# EAGLE design Grove - Water  Atomization v1.0 (EAGLE 7.1.0)

## Sheet 1 of 2
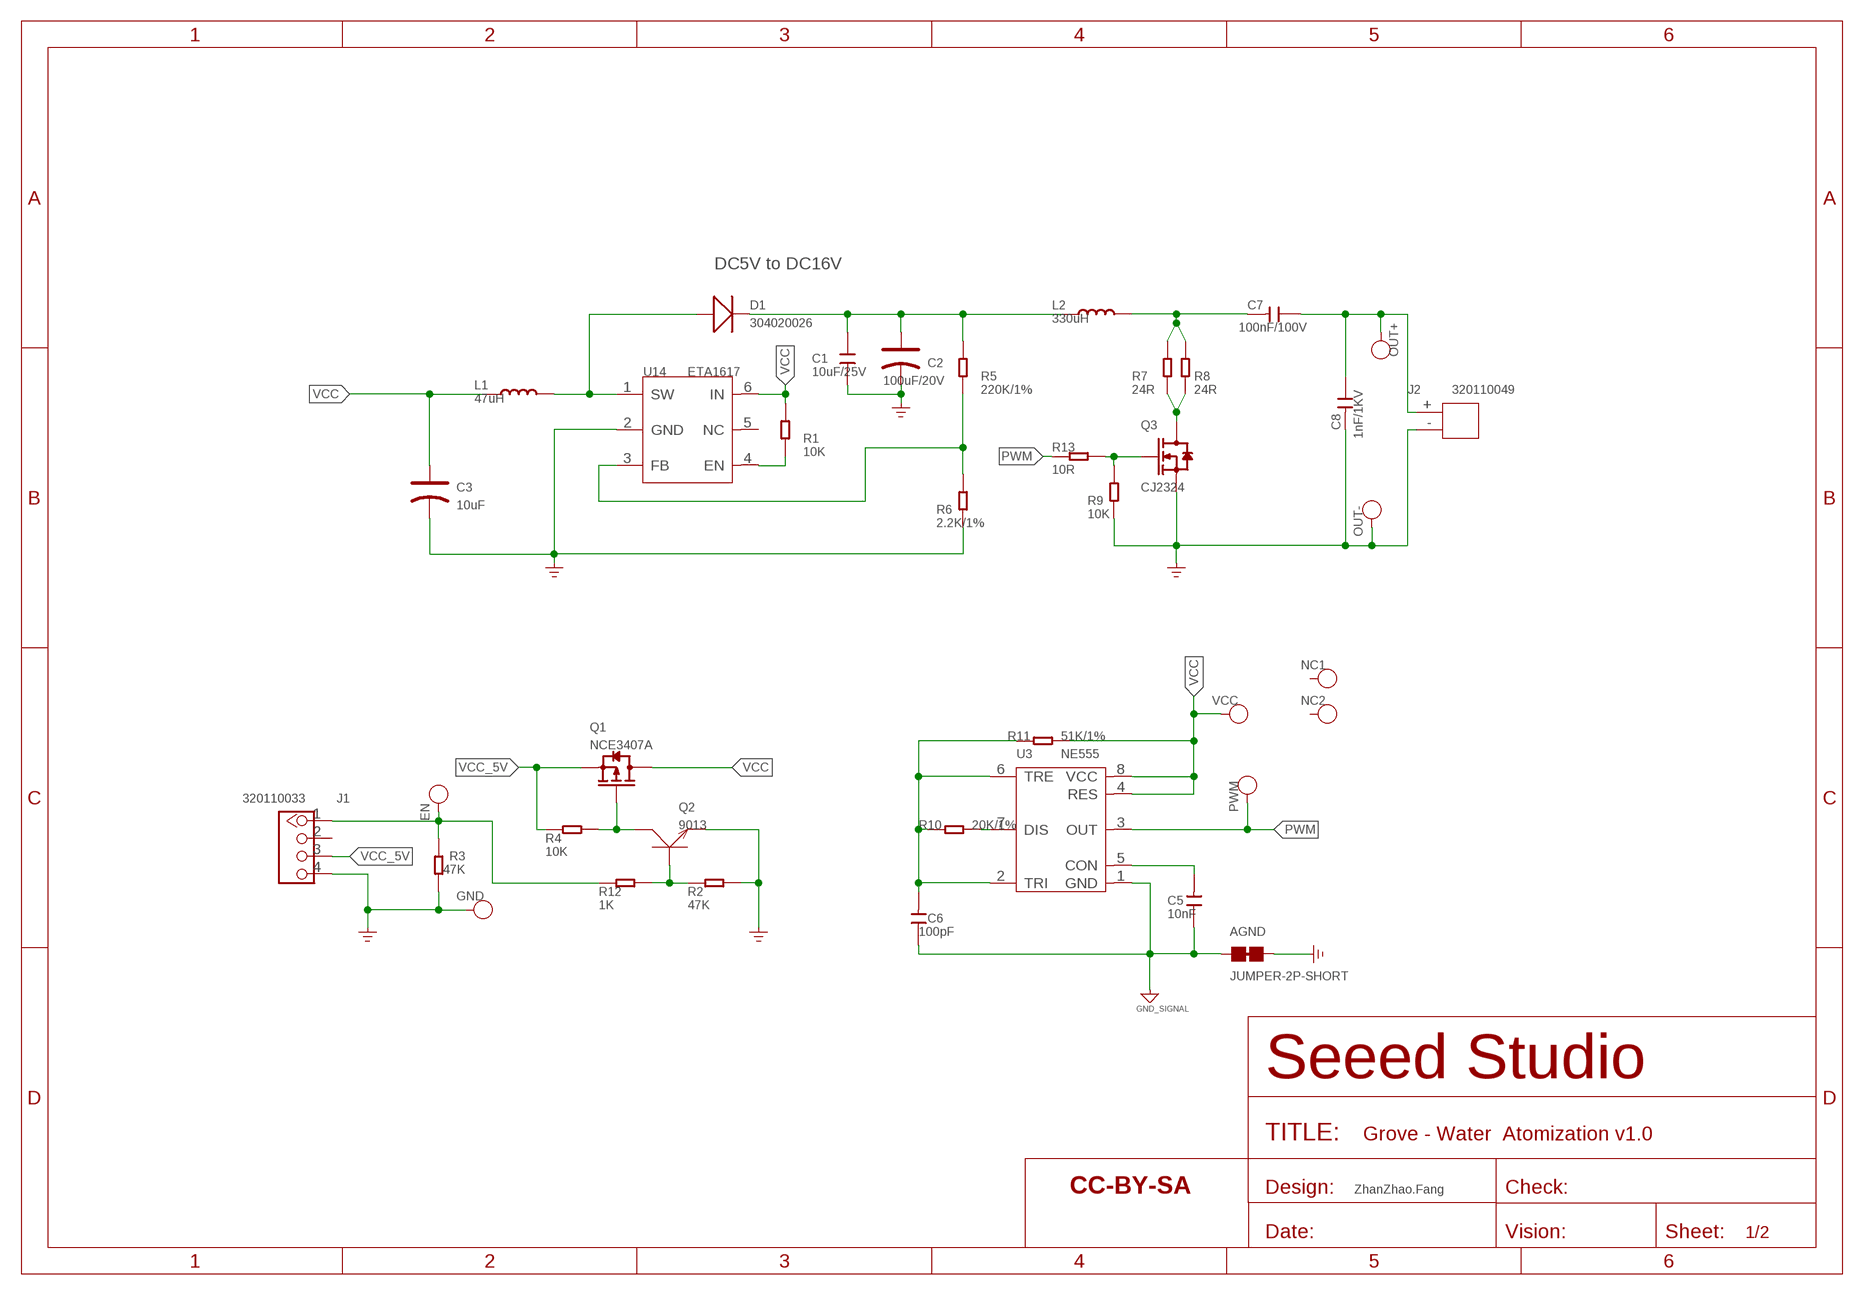
[diagram p0: schematic, sheet 1]

### Parts
AGND  JUMPER-2P-SHORT  [2P-SMD-SHORT]
C1  10uF/25V  CAP-1206  [C1206]
C2  100uF/20V  CAP-POLAR-AVX-D  [AVX-D]
C3  10uF  CAP-POLAR-AVX-B  [AVX-B]
C5  10nF  CAP-0402  [C0402]
C6  100pF  CAP-0402  [C0402]
C7  100nF/100V  CAP-0805  [C0805]
C8  1nF/1KV  CAP-1206  [C1206]
D1  304020026  DIODE'0805'  [SOD-323]
EN  DNP  TEST-POINT'4545'  [TP-D45MIL]
GND  DNP  TEST-POINT'4545'  [TP-D45MIL]
J1  320110033  GROVE-CONNECTOR-DIP-2.0  [HW4-2.0]
J2  320110049  JST-2P-DIP'2.0'  [H2-2.0-6X4.5MM]
L1  47uH  INDUCTOR/FERRITE-BEAD  [INT2-SMD-4.8X4.8X3MM]
L2  330uH  INDUCTOR/FERRITE-BEAD  [INT2-SMD-4.8X4.8X3MM]
NC1  DNP  TEST-POINT'4545'  [TP-D45MIL]
NC2  DNP  TEST-POINT'4545'  [TP-D45MIL]
OUT+  DNP  TEST-POINT'4545'  [TP-D45MIL]
OUT-  DNP  TEST-POINT'4545'  [TP-D45MIL]
PWM  DNP  TEST-POINT'4545'  [TP-D45MIL]
Q1  NCE3407A  MOSFET-P'SI2323CDS/SI2305DS<BR>'  [SOT-23]
Q2  9013  TRANSISTOR-NPN-SOT323  [SOT-323]
Q3  CJ2324  MOSFET-N'SOT23'  [SOT-23]
R1  10K  RES-0402  [R0402]
R2  47K  RES-0402  [R0402]
R3  47K  RES-0402  [R0402]
R4  10K  RES-0402  [R0402]
R5  220K/1%  RES-0402  [R0402]
R6  2.2K/1%  RES-0402  [R0402]
R7  24R  RES-0805  [R0805]
R8  24R  RES-0805  [R0805]
R9  10K  RES-0402  [R0402]
R10  20K/1%  RES-0402  [R0402]
R11  51K/1%  RES-0402  [R0402]
R12  1K  RES-0402  [R0402]
R13  10R  RES-0402  [R0402]
U3  NE555  CLOCK/TIMING-NE555'DR'  [SOIC8-1.27-5X4MM]
U14  ETA1617  PMIC-ETA1617  [SOT-23-6]
U$1  DNP  SEEEDSTUDIO-OPEN-SCH-FRAME  [SEEEDSTUDIO-PCB-FRAME]
VCC  DNP  TEST-POINT'4545'  [TP-D45MIL]

### Nets
\GND: AGND.1 C5.1 C6.1 U3.1(GND) ; supply symbol labelled GND_SIGNAL
EN: EN.T J1.1 R3.1 R12.2
FB: R5.1 R6.2 U14.3(FB)
GND: AGND.2 C1.2 C2.- C3.- C8.2 GND.T J1.4 J2.- OUT-.T Q2.2(E) Q3.2(S) R2.1 R3.2 R6.1 R9.1 U14.2(GND) ; supply symbol labelled GND_POWER
N$1: Q3.3(D) R7.1 R8.1
N$2: D1.+ L1.2 U14.1(SW)
N$3: R1.1 U14.4(EN)
N$4: C1.1 C2.+ D1.- L2.1 R5.2
N$5: Q1.1(G) Q2.3(C) R4.1
N$8: Q2.1(B) R2.2 R12.1
N$9: C5.2 U3.5(CON)
N$11: Q3.1(G) R9.2 R13.1
N$12: C7.2 L2.2 R7.2 R8.2
N$14: C7.1 C8.1 J2.+ OUT+.T
N$15: R10.1 U3.7(DIS)
N$18: C6.2 R10.2 R11.1 U3.2(TRI) U3.6(TRE)
PWM: PWM.T R13.2 U3.3(OUT)
VCC: C3.+ L1.1 Q1.3(D) R1.2 R11.2 U3.4(RES) U3.8(VCC) U14.6(IN) VCC.T
VCC_5V: J1.3 Q1.2(S) R4.2
Unconnected: J1.2 NC1.T NC2.T U14.5(NC)

### Notes on the sheet
- DC5V to DC16V
- ZhanZhao.Fang

## Sheet 2 of 2

## Library data of the parts
AGND = Discrete-new:JUMPER-2P-SHORT
C1 C5-C8 = Discrete-new:CAP: Ceramic Capacitors
C2 C3 = Discrete-new:CAP-POLAR: Electrolytic Capacitors,Tantalum Capacitors and Super Capacitors
D1 = Discrete-new:DIODE*
EN GND NC1 NC2 OUT+ OUT- PWM VCC = Discrete-new:TEST-POINT; PARTNO: DNP
J1 = Connector-new:GROVE-CONNECTOR-DIP: 4P-2.0:320110033;4P-2.0-90D:320110034
J2 = Connector-new:JST-2P-DIP: 2P-2.0:320110049;2P-2.0-90D:320110027;2P-2.54:320110053;2P-2.54-90D:320110000
L1 L2 = Discrete-new:INDUCTOR/FERRITE-BEAD
Q1 = Discrete-new:MOSFET-P
Q2 = Discrete-new:TRANSISTOR-NPN: NPN audion
Q3 = Discrete-new:MOSFET-N
R1-R13 = Discrete-new:RES
U3 = IC-new:CLOCK/TIMING-NE555: DIP-8:310110001;SOIC-8:310110013;TSSOP-8:310110002
U14 = template:PMIC-ETA1617
U$1 = moudle-new:SEEEDSTUDIO-OPEN-SCH-FRAME

## Board
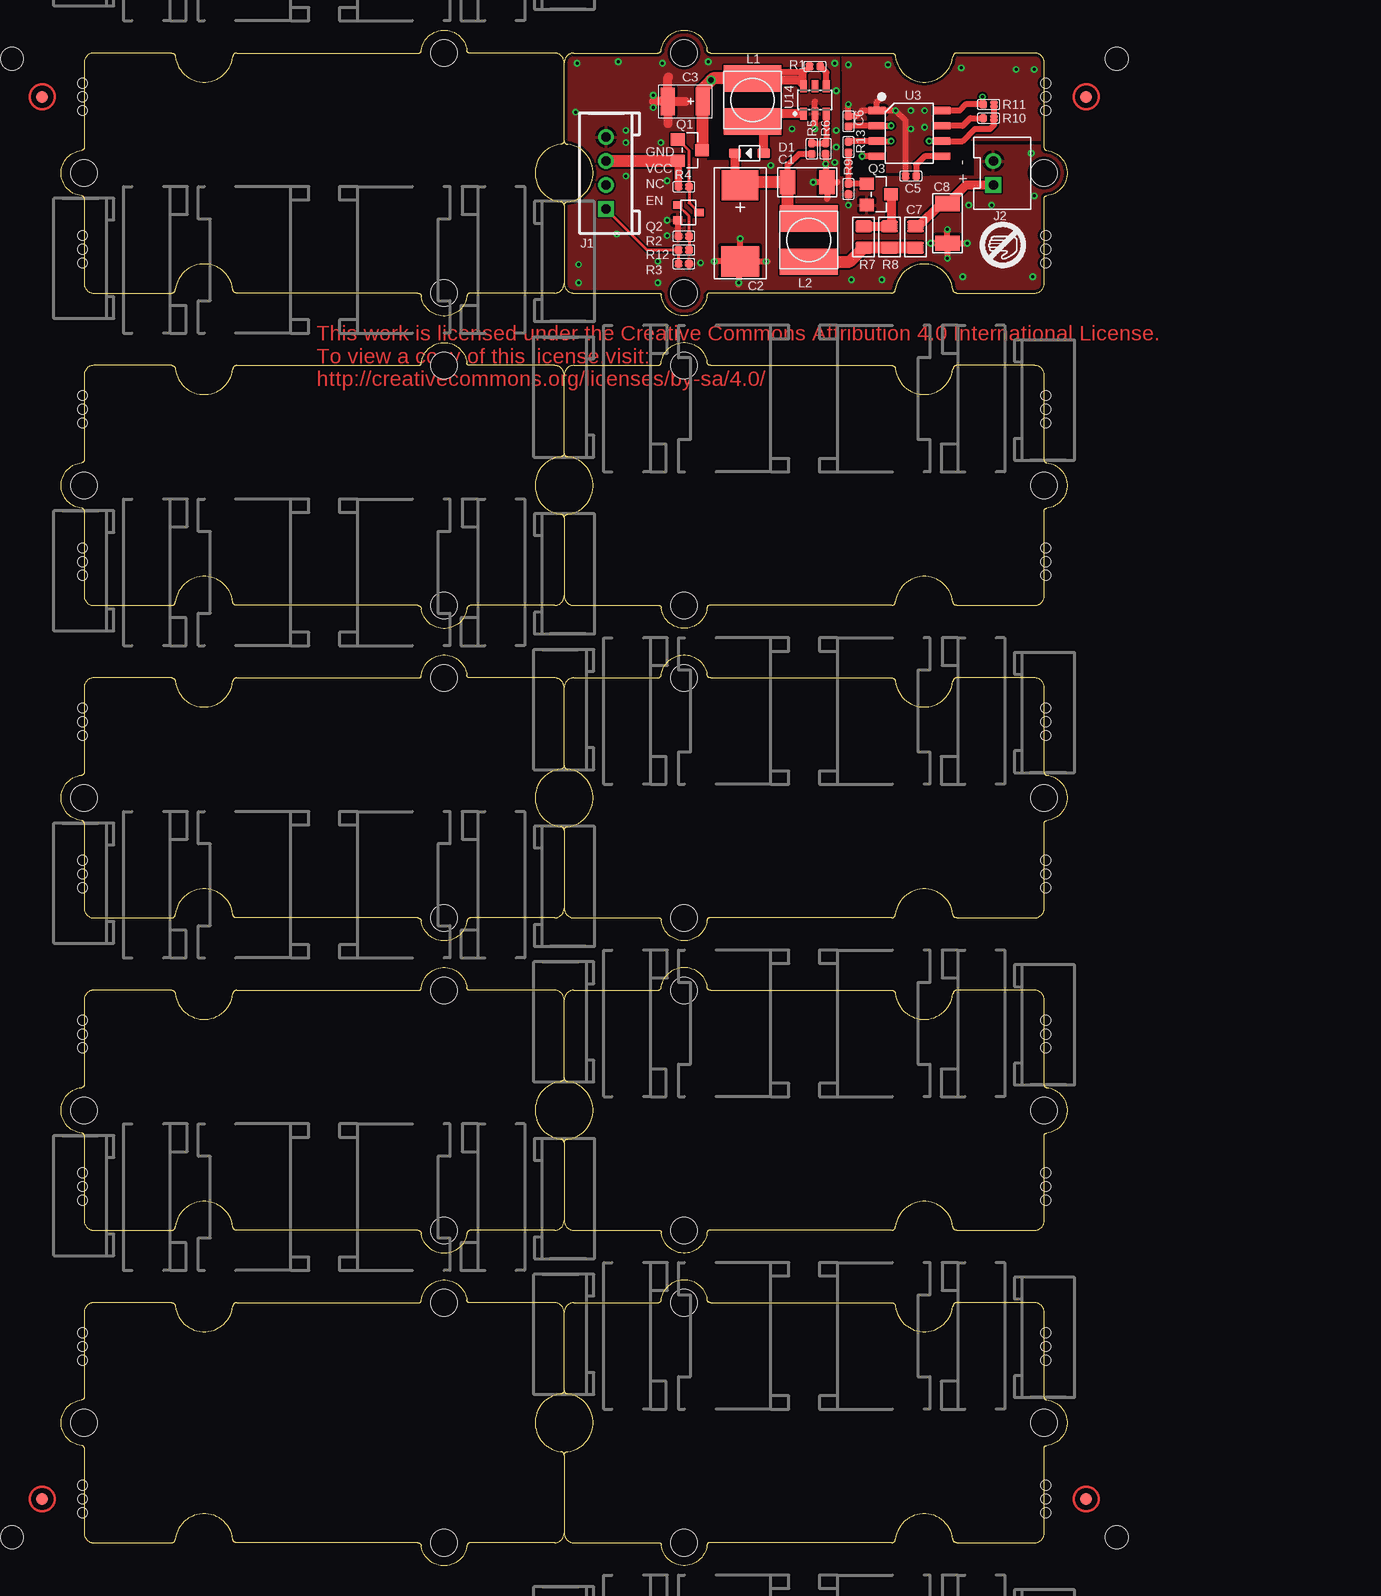
[diagram p1: board, top side]
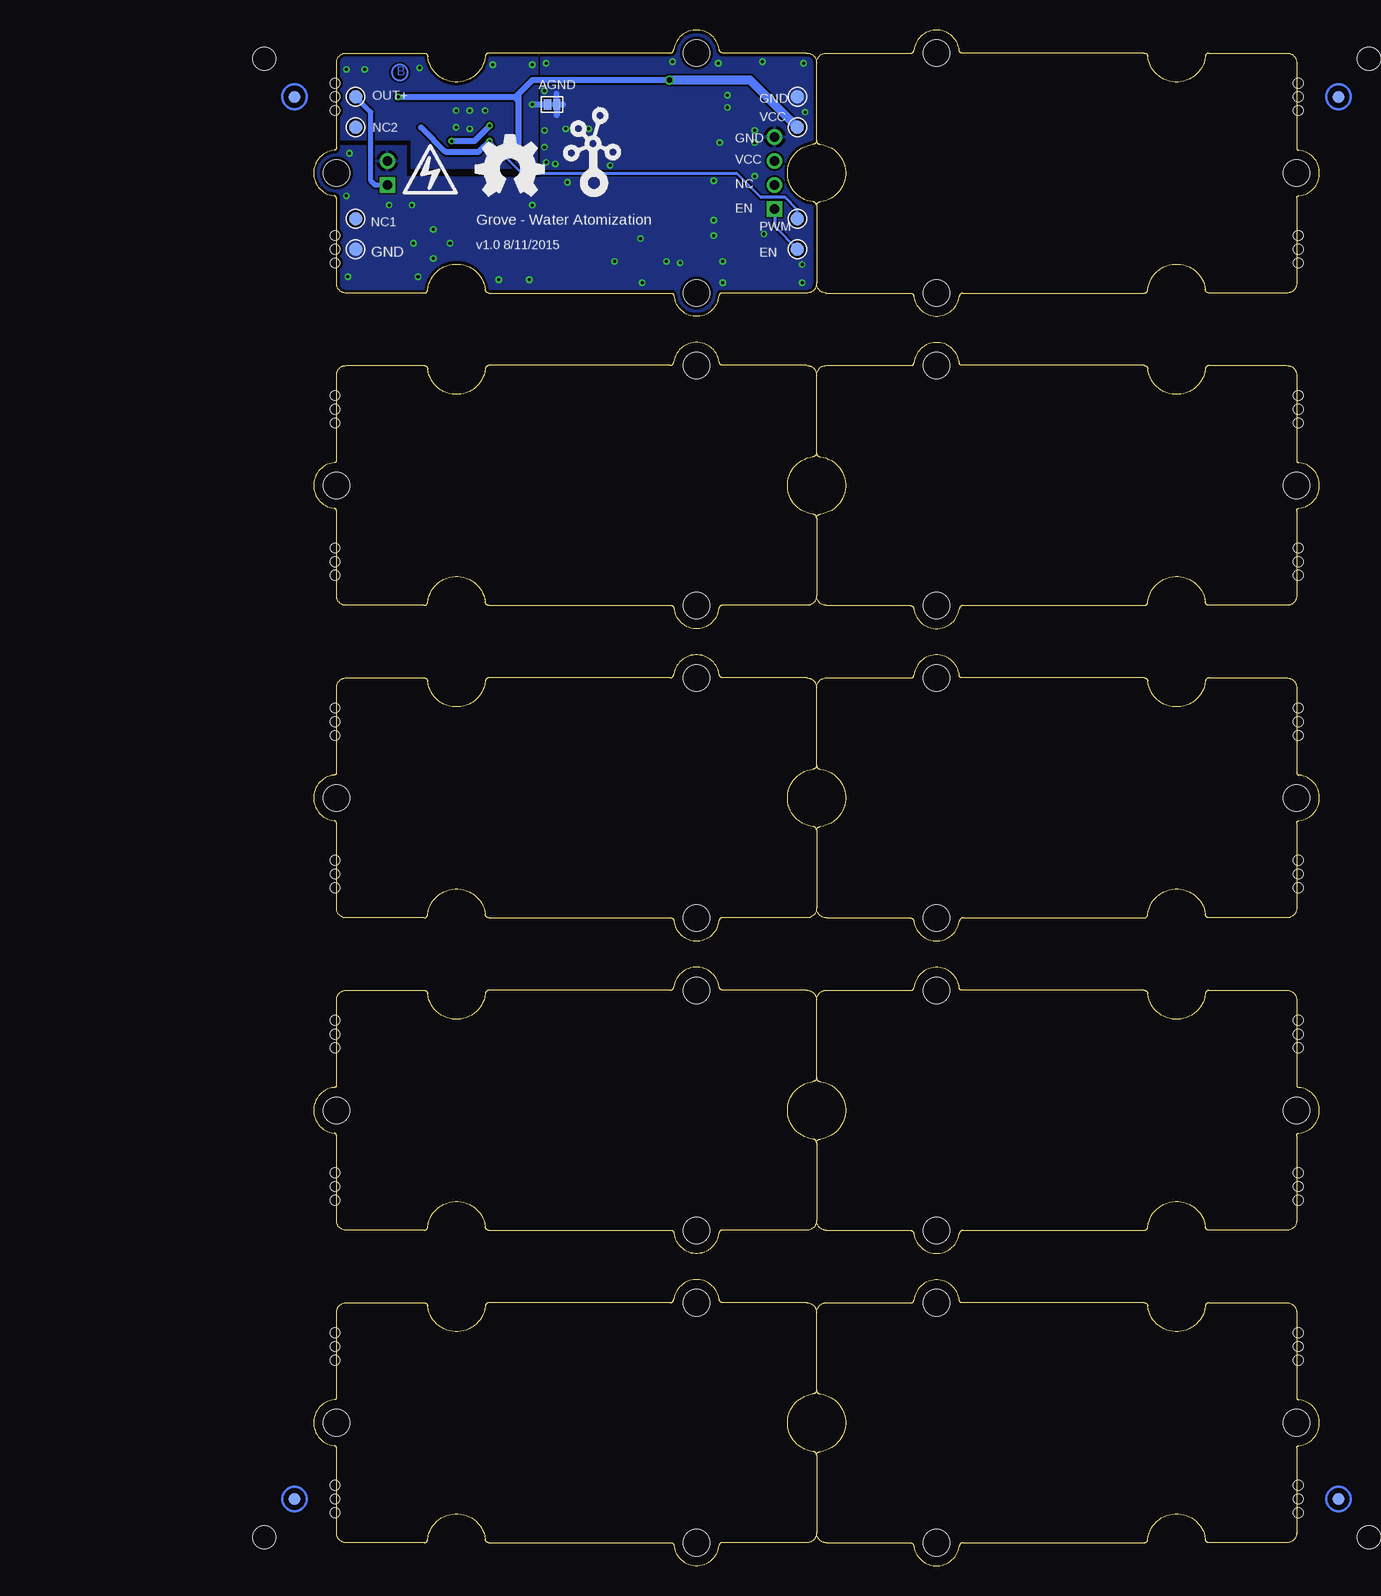
[diagram p2: board, bottom side, seen from below]

Size 83.82 x 127.98 mm. Coordinates in mm from the lower left corner, seen from the top.
Copper layers (1*16): Top 0.035mm / dielectric 1.5mm / Bottom 0.035mm
Design rules "SeeedStudio_2layer_DRU_no_angle_20140221 *": minimum track width 6mil, minimum drill 10mil, track to track 6mil, track to pad 6mil, pad to pad 6mil, via to via 6mil, smd to smd 0mil, copper to edge 10mil, drill to drill 10mil, minimum pad ring 10mil, minimum via ring 6mil, stop-mask expansion 2mil, vias tented up to drill 25mil, thermal gap 10mil
Holes 0.8 mm at 1.78,123.55 1.78,121.27 1.78,122.41 1.78,110.85 1.78,108.57 1.78,109.71 1.78,97.52 1.78,95.23 1.78,96.38 1.78,84.82 1.78,82.53 1.78,83.68 1.78,71.48 1.78,69.2 1.78,70.34 1.78,58.78 1.78,56.5 1.78,57.64 1.78,45.45 1.78,43.16 1.78,44.31 1.78,32.75 1.78,30.46 1.78,31.61 1.78,19.41 1.78,17.13 1.78,18.27 1.78,6.71 1.78,4.43 1.78,5.57 82.04,121.27 82.04,123.55 82.04,122.41 82.04,108.57 82.04,110.85 82.04,109.71 82.04,95.23 82.04,97.52 82.04,96.38 82.04,82.53 82.04,84.82 82.04,83.68 82.04,69.2 82.04,71.48 82.04,70.34 82.04,56.5 82.04,58.78 82.04,57.64 82.04,43.16 82.04,45.45 82.04,44.31 82.04,30.46 82.04,32.75 82.04,31.61 82.04,17.13 82.04,19.41 82.04,18.27 82.04,4.43 82.04,6.71 82.04,5.57
Holes 1.91 mm at -4.13,2.4 87.95,2.4 87.95,125.59 -4.13,125.59

### Footprints (pad centres in the part's own frame; a part is rotated, then mirrored left to right if it is on the bottom)
2P-SMD-SHORT = smd 0.889 x 0.61: 1 0,0.381; 2 0,-0.381
C1206 = smd 1.27 x 2.032: 1 -1.651,0; 2 1.651,0
AVX-D = smd 2.54 x 3.048: + -3.175,0 | smd 2.54 x 3.175: - 3.175,0
AVX-B = smd 1.143 x 2.286: + -1.46,0; - 1.46,0
C0402 = smd 0.635 x 0.635: 1 0,0.445; 2 0,-0.445
C0805 = smd 1.397 x 1.016: 1 0,0.889; 2 0,-0.889
SOD-323 = smd 1 x 0.8: + -1.2,0; - 1.2,0
TP-D45MIL = smd 1.143 x 1.143: T 0,0
HW4-2.0 = drill 0.8 pad 1.27 square: 1 -3,0 | drill 0.8 pad 1.27: 2 -1,0; 3 1,0; 4 3,0
H2-2.0-6X4.5MM = drill 0.8 pad 1.3 square: + -1,0.75 | drill 0.8 pad 1.3: - 1,0.75
INT2-SMD-4.8X4.8X3MM = smd 2.2 x 4.8: 1 -1.8,0; 2 1.8,0
ROUND-MARK-1.0 = smd 1.016 x 1.016: P$1 0,0
SOT-23 = smd 1.016 x 1.143: 1 -0.889,-1.016; 2 0.889,-1.016; 3 0,1.016
SOT-323 = smd 0.635 x 0.762: 1 -0.635,-0.889; 2 0.635,-0.889; 3 0,0.889
R0402 = smd 0.635 x 0.635: 1 0,0.445; 2 0,-0.445
R0805 = smd 1.397 x 1.016: 1 0,0.889; 2 0,-0.889
SOIC8-1.27-5X4MM = smd 0.6 x 1.4: 1 -1.905,-2.7; 2 -0.635,-2.7; 3 0.635,-2.7; 4 1.905,-2.7; 5 1.905,2.7; 6 0.635,2.7; 7 -0.635,2.7; 8 -1.905,2.7
GROVE-TEST-PLATFORM = hole 2.2: -10,-10; -10,10; 20,0
SOT-23-6 = smd 0.55 x 1.016: 1 -0.95,-1.143; 2 0,-1.143; 3 0.95,-1.143; 4 0.95,1.143; 5 0,1.143; 6 -0.95,1.143

### Placement (x,y rotation side)
AGND  63.95,121.78 90 bottom
C1  62.17,115.3 0 top
C2  56.58,111.87 270 top
C3  52.01,122.03 180 top
C5  70.8,115.81 90 top
C6  65.6,120.38 0 top
C7  71.18,110.73 0 top
C8  73.85,111.87 270 top
D1  57.34,117.71 180 top
EN  43.5,109.71 0 bottom
GND  43.5,122.41 0 bottom
J1  45.4,116.06 90 top
J2  78.42,116.06 90 top
L1  57.6,122.16 270 top
L2  62.29,110.47 270 top
NC1  80.33,112.25 0 bottom
NC2  80.33,119.87 0 bottom
OUT+  80.33,122.41 0 bottom
OUT-  80.33,109.71 0 bottom
P1  [ROUND-MARK-1.0]  -1.59,5.57 0 top
P2  [ROUND-MARK-1.0]  85.41,5.57 0 top
P3  [ROUND-MARK-1.0]  -1.59,122.41 0 top
P4  [ROUND-MARK-1.0]  85.41,122.41 0 top
P5  [ROUND-MARK-1.0]  -1.59,5.57 0 bottom
P6  [ROUND-MARK-1.0]  85.41,5.57 0 bottom
P7  [ROUND-MARK-1.0]  85.41,122.41 0 bottom
P8  [ROUND-MARK-1.0]  -1.59,122.41 0 bottom
PWM  43.5,112.25 0 bottom
Q1  52.39,117.97 270 top
Q2  52.26,112.76 270 top
Q3  68.14,114.28 270 top
R1  62.8,124.95 270 top
R2  51.88,110.79 90 top
R3  51.88,108.5 90 top
R4  51.88,114.92 270 top
R5  62.55,118.09 0 top
R6  63.69,118.09 180 top
R7  66.87,110.73 0 top
R8  69.03,110.73 0 top
R9  65.6,114.73 180 top
R10  77.28,120.63 90 top
R11  77.28,121.78 270 top
R12  51.88,109.65 270 top
R13  65.6,118.22 180 top
U3  70.68,119.36 270 top
U4  [GROVE-TEST-PLATFORM]  61.91,37.96 0 top
U5  [GROVE-TEST-PLATFORM]  21.91,37.96 180 top
U6  [GROVE-TEST-PLATFORM]  61.91,63.99 0 top
U7  [GROVE-TEST-PLATFORM]  21.91,63.99 180 top
U8  [GROVE-TEST-PLATFORM]  61.91,90.03 0 top
U9  [GROVE-TEST-PLATFORM]  21.91,90.03 180 top
U10  [GROVE-TEST-PLATFORM]  21.91,116.06 180 top
U11  [GROVE-TEST-PLATFORM]  61.91,116.06 0 top
U12  [GROVE-TEST-PLATFORM]  61.91,11.92 0 top
U13  [GROVE-TEST-PLATFORM]  21.91,11.92 180 top
U14  62.8,122.16 0 top
U$1  21.27,98.28 0 top
U$5  [OSHW_FILLX200_NOTEXT]  70.3,114.16 0 bottom
U$7  [GROVE-SILK-BIG]  60.52,115.05 0 bottom
VCC  43.5,119.87 0 bottom

### Tracks (layer width: path | path; a pad name or v marks a point on that pad's centre or on a via)
\GND  (via drill 0.25 pad 0.51)
  Top 0.508: C5.1 70.36,120.44 v69.53,121.27 U3.1 | U3.1 66.74,121.27 66.29,120.82 C6.1 v65.6,121.78 | U3.1 67.98,122 68.01,122.03
  Bottom 0.508: v65.6,121.78 AGND.1
  other vias: 71.95,121.27 71.95,119.87 70.8,119.74 70.8,121.27 65.6,125.08 68.9,125.08 74.99,124.82 79.57,124.7 81.09,124.7
  pour Top (rank 6): 65.09,126.22 65.22,116.19 75.63,116.19 75.63,118.86 82.87,118.86 82.74,126.22
  pour Bottom (rank 6): 65.09,126.48 65.22,116.44 75.63,116.44 75.63,118.86 82.61,118.86 82.74,126.48
EN
  Top 0.254: R3.1 R12.2 48.82,109.65 J1.1
  Bottom 0.254: J1.1 45.4,111.62 EN.T
FB
  Top 0.508: R5.1 R6.2 63.75,118.54 U14.3
GND  (via drill 0.25 pad 0.51)
  Top 0.508: Q2.2 51.37,110.85 R2.1 | R6.1 63.69,116.06 | C2.- v56.58,110.6 | C2.- v54.42,108.7 | C2.- 58.87,108.7 | C2.- 56.45,108.57 56.45,106.79 | C1.2 v62.67,115.3 | C1.2 63.82,113.9 | C1.2 64.71,115.3 | 62.8,119.87 U14.2 62.8,122.03 | C8.2 75.38,110.22 | C8.2 72.58,110.22 | C8.2 73.85,111.24 | C8.2 73.85,109.08
  Top 0.762: C3.- 50.55,124 50.61,124.06 | C3.- 49.34,122.03 | C3.- 52.01,122.03 | C3.- 50.55,120.19
  Bottom 0.508: AGND.2 63.06,121.78 | AGND.2 63.56,122.67 | AGND.2 63.56,120.89
  other vias: 73.85,111.36 63.69,116.82 65.6,113.39 49.34,122.54 49.34,121.52 50.1,125.21 50.48,110.85 50.48,112.12 73.85,108.95 62.8,119.74 60.9,119.74 58.74,108.7 56.45,106.92 53.28,108.57 64.45,116.95 42.99,125.21 46.42,125.33 49.98,118.6 47.05,118.6 47.05,119.62 80.96,107.43 75.12,107.43 81.09,114.16 80.84,117.71 68.39,107.17 65.85,107.17 43.12,106.92 49.72,106.92 49.72,108.7 43.12,108.44 46.29,110.98 47.05,115.81 50.48,115.43 42.86,121.14 75.63,113.39 77.53,113.39 75.5,110.22 72.45,110.22 53.91,125.33 64.45,125.21 64.58,122.92 64.58,119.62 64.58,118.22 59.12,116.7
  pour Bottom: 41.21,128.25 40.96,103.87 84.01,103.62 84.14,118.35 76.14,118.35 76.14,115.81 64.83,115.68 64.83,128.13
  pour Top: 41.21,128.51 40.96,104.12 84.01,103.87 84.14,118.35 76.14,118.35 76.14,115.81 64.83,115.68 64.83,128.38
N$1
  Top 0.762: R7.1 R8.1 69.15,111.74 Q3.3
N$2
  Top 0.508: 57.98,120.76 57.72,120.76 57.47,121.01 57.34,121.01 56.45,120.13 | L1.2 57.6,120.38 57.98,120.76 | U14.1 61.53,121.01 58.99,121.01 58.61,120.63 | 58.1,120.63 57.98,120.76
  Top 0.762: 56.14,119.81 56.27,119.94 | D1.+ 58.54,120.13 | 58.54,120.13 58.48,120.13 | 58.54,120.13 58.54,120.63 | 58.54,120.63 58.1,120.63 | 61.53,121.01 59.12,121.01 58.99,120.89 58.8,120.89 58.54,120.63
  Top 1.016: 56.27,119.94 56.45,120.13
N$3
  Top 0.508: U14.4 63.75,124.45 R1.1
N$4
  Top 0.508: R5.2 61.47,117.65 60.52,116.7 C1.1
  Top 0.762: D1.- 56.14,115.05 C2.+
  Top 1.016: L2.1 arc90 62.19,112.38 60.9,112.38 60.52,112.76 C1.1 56.83,115.3 C2.+ 56.71,115.05 56.96,115.3 56.71,115.55
N$5
  Top 0.254: Q2.3 52.32,113.58 R4.1 52.32,117.9 Q1.1
N$6
  cutout Top: 55.18,124.57 60.01,124.57 60.01,119.74 55.18,119.74
  cutout Top: 59.88,112.89 64.71,112.89 64.71,108.06 59.88,108.06
N$7
  cutout Top: 53.91,118.22 58.23,118.22 58.23,117.2 53.91,117.2
N$8
  Top 0.254: 52.32,109.77 R12.1 R2.2 52.32,112.44 Q2.1
N$9
  Top 0.508: U3.5 71.95,117.46 71.25,116.76 C5.2
N$10
  cutout Top: 72.84,121.52 74.23,121.52 74.23,116.19 72.84,116.19
  cutout Top: 67.25,121.4 68.64,121.4 68.64,116.06 67.25,116.06
N$11
  Top 0.508: Q3.1 R9.2 R13.1
N$12
  Top 1.016: C7.2 R8.2 R7.2 65.7,108.67 L2.2
N$14
  Top 0.762: J2.+ 75.39,115.06 C8.1 73.34,113.52 71.44,111.62 C7.1
  Bottom 0.406: J2.+ 78.69,115.06 79.06,115.43 79.06,121.14 OUT+.T
  Bottom 0.762: J2.+ 77.67,114.91
N$15
  Top 0.508: R10.1 75.76,120.63 75.12,120 U3.7
N$18  (via drill 0.25 pad 0.51)
  Top 0.508: C6.2 65.6,120 U3.2 v69.15,120 | R11.1 R10.2 77.72,120.06 77.41,119.74 76.14,119.74 75.12,118.73 U3.6 v72.33,118.73
  Bottom 0.508: v69.15,120 70.42,118.73 v72.33,118.73
PWM  (via drill 0.25 pad 0.51)
  Top 0.508: R13.2 65.6,118.73 U3.3 v69.15,118.73
  Bottom 0.254: PWM.T 43.5,113.01 44.51,114.03 46.55,114.03 48.58,116.06 66.48,116.06 v69.15,118.73
  Bottom 0.508: 74.87,119.87 72.83,117.84 70.04,117.84 v69.15,118.73
VCC  (via drill 0.25 pad 0.51, 0.46 pad 0.76)
  Top 0.508: L1.1 61.19,123.96 | 61.19,123.96 U14.6 | U3.4 v66.74,117.46 | v76.77,122.41 76.77,121.84 R11.2 75.38,121.78 74.87,121.27 U3.8 | R1.2 61.85,124.45 | 61.85,124.45 U14.6 | 61.19,123.96 61.55,123.96 61.79,124.19 | 61.85,124.45 59.38,124.45 59.37,124.44 | U14.6 61.47,123.68 59.37,123.68
  Top 1.016: L1.1 54.31,123.96 v54.17,123.81 53.4,123.05 53.4,122.41 | 53.4,122.41 Q1.3 | C3.+ 53.47,122.35 53.4,122.41
  Bottom 0.508: v76.77,122.41 67.12,122.41 | 66.99,122.41 66.74,122.41 | v66.74,117.46 66.74,122.03 | 66.74,122.03 66.74,122.41 | 66.74,122.41 66.74,122.67 | 67.12,122.41 66.99,122.41 | 66.99,122.41 66.74,122.67 | 67.12,122.41 66.74,122.03 | v54.17,123.81 65.6,123.81 66.74,122.67
  Bottom 0.762: VCC.T 47.44,123.81 v54.17,123.81
VCC_5V
  Top 0.635: R4.2 51.44,117.08 50.61,117.08
  Top 1.016: J1.3 45.4,117.08 50.61,117.08 Q1.2
(copper drawn outside any net)
  shapes: Bottom circle x1

### Text on the board
Bottom: B
tPlace: GND | - | VCC | NC | + | EN
bPlace: GND | VCC | NC | EN | Grove - Water Atomization | v1.0 8/11/2015 | GND